# EAGLE design Qwiic_Hall_Effect_Sensor_TMAG5273 (EAGLE 9.6.2)
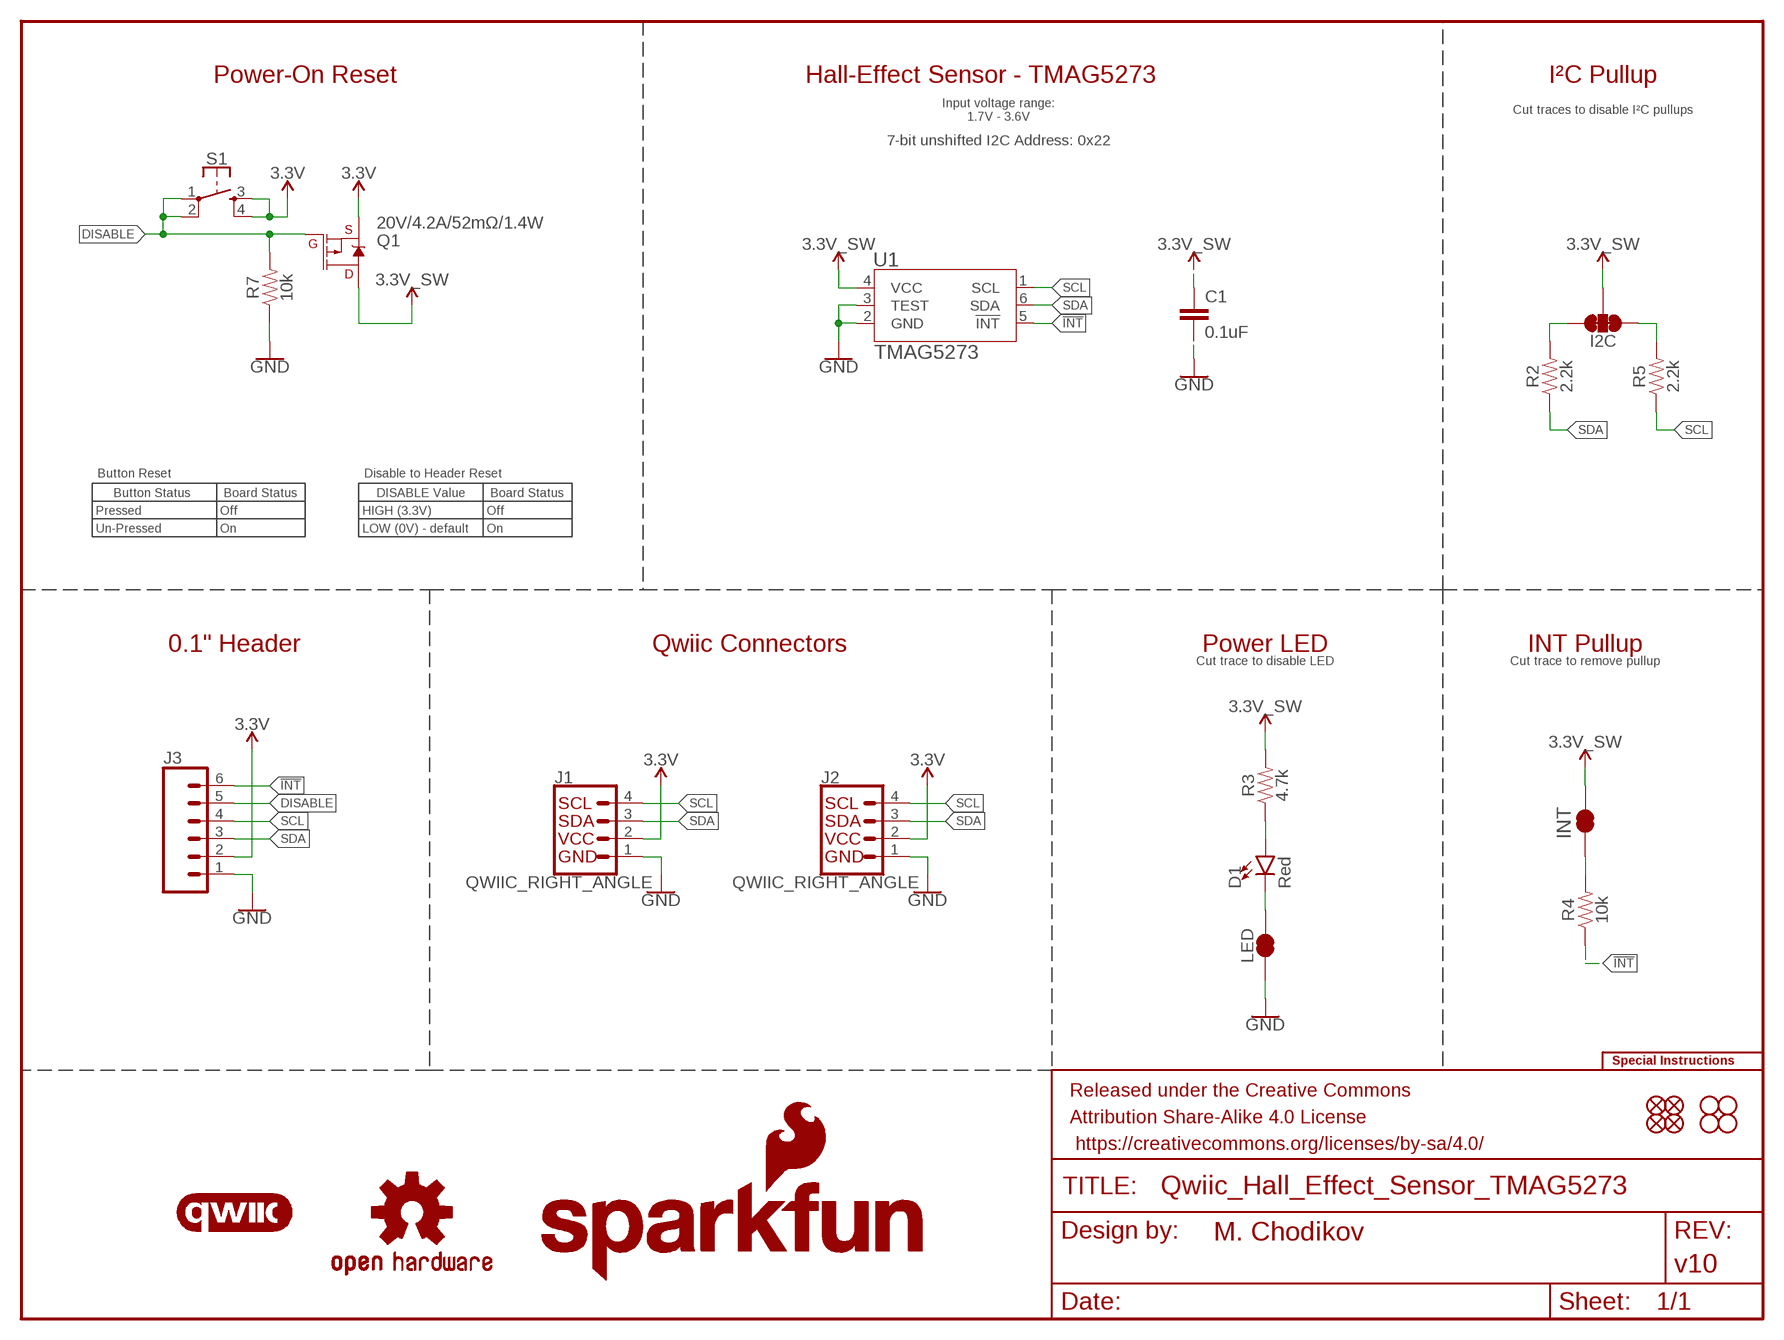
[diagram p0: schematic, sheet 1]

## Parts
C1  0.1uF  0.1UF-0603-25V-10%-X7R-WE  [0603]
D1  Red  LED-RED_0603-KB  [LED-0603]
FD1  FIDUCIAL1X2  [FIDUCIAL-1X2]
FD2  FIDUCIAL1X2  [FIDUCIAL-1X2]
FD3  FIDUCIAL1X2  [FIDUCIAL-1X2]
FD4  FIDUCIAL1X2  [FIDUCIAL-1X2]
FRAME1  FRAME-LETTER  [CREATIVE_COMMONS]
H1  STAND-OFF  [STAND-OFF]
H2  STAND-OFF  [STAND-OFF]
H3  STAND-OFF  [STAND-OFF]
H4  STAND-OFF  [STAND-OFF]
I2C  JUMPER-SMT_3_2-NC_TRACE_SILK  [SMT-JUMPER_3_2-NC_TRACE_SILK]
J1  QWIIC_RIGHT_ANGLE  QWIIC_CONNECTORJS-1MM  [JST04_1MM_RA]
J2  QWIIC_RIGHT_ANGLE  QWIIC_CONNECTORJS-1MM  [JST04_1MM_RA]
J3  CONN_06NO_SILK_FEMALE_PTH  [1X06_NO_SILK]
JP2  JUMPER-SMT_2_NC_TRACE_SILK  [SMT-JUMPER_2_NC_TRACE_SILK]
LED  JUMPER-SMT_2_NC_TRACE_SILK  [SMT-JUMPER_2_NC_TRACE_SILK]
LOGO1  OSHW-LOGOS  [OSHW-LOGO-S]
LOGO2  SFE_LOGO_NAME_FLAME.1_INCH  [SFE_LOGO_NAME_FLAME_.1]
LOGO3  QWIIC_LOGO_4MM  [QWIIC_4MM]
LOGO4  SFE_LOGO_NAME8_MM  [SFE_LOGO_NAME_8MM]
LOGO5  SPECIAL_INSTRUCTIONS-ORDERING  [ORDERING_INSTRUCTIONS]
LOGO6  SFE_LOGO_FLAME.1_INCH  [SFE_LOGO_FLAME_.1]
Q1  20V/4.2A/52mΩ/1.4W  MOSFET_PCH-DMG2305UX-7  [SOT23-3]
R2  2.2k  2.2KOHM-0603-1/10W-1%  [0603]
R3  4.7k  4.7KOHM-0603-1/10W-1%  [0603]
R4  10k  10KOHM-0603-1/10W-1%  [0603]
R5  2.2k  2.2KOHM-0603-1/10W-1%  [0603]
R7  10k  10KOHM-0603-1/10W-1%  [0603]
S1  MOMENTARY-SWITCH-SPST-2-SMD-4.6X2.8MM  [TACTILE_SWITCH_SMD_4.6X2.8MM]
U1  TMAG5273  TMAG5273A1QDBVT  [SOT23-6_DBV_TEX]

## Nets
3.3V: J1.2 J2.2 J3.2 Q1.2(S) S1.3 S1.4
3.3V_SW: C1.1 I2C.2 JP2.2 Q1.3(D) R3.2 U1.4(VCC)
!INT: J3.6 R4.1 U1.5(!INT)
DISABLE: J3.5 Q1.1(G) R7.2 S1.1 S1.2
GND: C1.2 J1.1 J2.1 J3.1 LED.1 R7.1 U1.2(GND) U1.3(TEST)
N$1: D1.C LED.2
N$2: I2C.3 R2.2
N$4: D1.A R3.1
N$5: JP2.1 R4.2
N$6: I2C.1 R5.2
SCL: J1.4 J2.4 J3.4 R5.1 U1.1(SCL)
SDA: J1.3 J2.3 J3.3 R2.1 U1.6(SDA)

## Notes on the sheet
- Power-On Reset | Hall-Effect Sensor - TMAG5273 | I²C Pullup
- Input voltage range:
  1.7V - 3.6V
- Cut traces to disable I²C pullups
- 7-bit unshifted I2C Address: 0x22
- Button Reset | Disable to Header Reset
- Button Status | Board Status | DISABLE Value | Board Status
- Pressed | Off | HIGH (3.3V) | Off
- Un-Pressed | On | LOW (0V) - default | On
- 0.1" Header | Qwiic Connectors | Power LED | INT Pullup
- Cut trace to disable LED | Cut trace to remove pullup
- INT

## Library data of the parts
C1 = SparkFun-Capacitors:0.1UF: 0.1µF ceramic capacitors A capacitor is a passive two-terminal electrical component used to store electrical energy temporarily in an electric field.; PROD_ID: CAP-16503
D1 = SparkFun-LED:LED-RED: Red SMD LED Used in manufacturing of most products at SparkFun Packages: 0603 - KB - KingBright (DIO-17976) SMD 0603 package [Datasheet] <https://www.kingbrightusa.com/images/catalog/SPEC/APT1608SURCK.pdf> 0603 - (DIO-00819, has gone EOL) SMD 0603 package 0603 SMART - SMD 0603 SMART package ( more efficient and expensive)[Product Link] <http://www.osram-os.com/Graphics/XPic2/00077099_0.pdf> 1206 - SMD1206 package [Product Link] <https://www.sparkfun.com/datasheets/DevTools/LilyPad/Q150OVS4.pdff> SparkFun Products: Pro Mini 328 -5V <https://www.sparkfun.com/products/821> RedBoard <https://www.sparkfun.com/products/12757> IOIO-OTG <https://www.sparkfun.com/products/13613>; PROD_ID: DIO-17976
FD1-FD4 = SparkFun-Aesthetics:FIDUCIAL: Fiducial Alignment Points Point-of-reference for pick-and-place machines and other optical instruments.
FRAME1 = SparkFun-Aesthetics:FRAME-LETTER: Schematic Frame - Letter Standard 8.5x11 US Letter frame; DESIGNER: M. Chodikov; REV: v10
H1-H4 = SparkFun-Hardware:STAND-OFF: Stand Off Drill holes for mechanically mounting via screws, standoffs, etc. Note: Use the keepout ring to avoid running the screw head into surrounding components. Variant Overviews STAND-OFF - Mechanical footprint for a #4 phillips button head screw. STAND-OFF-TIGHT - Mechanical footprint for a #4 phillips button head screw, Example SparkFun Products Screw - Phillips Head (1/4", 4-40, 10 pack) <https://www.sparkfun.com/products/10453> (PRT-10453) Screw - Phillips Head (1/2", 4-40, 10 pack) <https://www.sparkfun.com/products/10452> (PRT-10452) Screw - Phillips Head (3/4", 4-40, 10 pack) <https://www.sparkfun.com/products/10451> (PRT-10451) Screw - Phillips Head (1", 4-40, 10 pack) <https://www.sparkfun.com/products/10450> (PRT-10450)
I2C = SparkFun-Jumpers:JUMPER-SMT_3_2-NC_TRACE: Normally closed trace jumper (2 of 2 connections) This jumper has a trace between all three pads so they are normally closed (NC). Use a razor knife to open the connection(s). For best results follow the IPC guidelines for cutting traces: Cutout at least 0.063 mm (0.005 in). Remove all loose material to clean up the cut area. Seal the cut with an approved epoxy. Reapply solder to reclose the connection(s).
J1 J2 = SparkFun-Connectors:QWIIC_CONNECTOR: SparkFun I2C Standard Qwiic Connector An SMD 1mm pitch JST connector makes it easy and quick (get it? Qwiic?) to connect I2C devices to each other. The Qwiic system <http://www.sparkfun.com/qwiic> enables fast and solderless connection between popular platforms and various sensors and actuators. We carry 200mm <https://www.sparkfun.com/products/14204>, 100mm <https://www.sparkfun.com/products/14205>, 50mm <https://www.sparkfun.com/products/14206>, and breadboard friendly <https://www.sparkfun.com/products/14207> Qwiic cables. We also offer 10 pcs strips <https://www.sparkfun.com/products/14323> the SMD connectors.; PROD_ID: CONN-13694
J3 = SparkFun-Connectors:CONN_06: Multi connection point. Often used as Generic Header-pin footprint for 0.1 inch spaced/style header connections On any of the 0.1 inch spaced packages, you can populate with these: Break Away Headers - Straight <https://www.sparkfun.com/products/116> (PRT-00116) Break Away Male Headers - Right Angle <https://www.sparkfun.com/products/553> (PRT-00553) Female Headers <https://www.sparkfun.com/products/115> (PRT-00115) Break Away Headers - Machine Pin <https://www.sparkfun.com/products/117> (PRT-00117) Break Away Female Headers - Swiss Machine Pin <https://www.sparkfun.com/products/743> (PRT-00743) Arduino Stackable Header - 6 Pin <https://www.sparkfun.com/products/9280> (PRT-09280) Screw Terminals 2.54mm Pitch (6-Pin) <https://www.sparkfun.com/products/16499> (PRT-16499) For SCREWTERMINALS and SPRING TERMINALS visit here: Screw Terimnals on SparkFun.com <https://www.sparkfun.com/search/results?term=Screw+Terminals> (5mm/3.5mm/2.54mm spacing) This device is also useful as a general connection point to wire up your design to another part of your project. Our various solder wires solder well into these plated through hole pads. Hook-Up Wire - Assortment (Stranded, 22 AWG) <https://www.sparkfun.com/products/11375> (PRT-11375) Hook-Up Wire - Assortment (Solid Core, 22 AWG) <https://www.sparkfun.com/products/11367> (PRT-11367) View the entire wire category on our website here <https://www.sparkfun.com/categories/141>; PROD_ID: CONN-08437
JP2 LED = SparkFun-Jumpers:JUMPER-SMT_2_NC_TRACE: Normally closed trace jumper This jumper has a trace between two pads so it's normally closed (NC). Use a razor knife to open the connection. For best results follow the IPC guidelines for cutting traces: Cutout at least 0.063 mm (0.005 in). Remove all loose material to clean up the cut area. Seal the cut with an approved epoxy. Reapply solder to reclose the connection.
LOGO1 = SparkFun-Aesthetics:OSHW-LOGO: Open-Source Hardware (OSHW) Logo This logo indicates the piece of hardware it is found on incorporates a OSHW license and/or adheres to the definition of open source hardware found here: http://freedomdefined.org/OSHW
LOGO2 = SparkFun-Aesthetics:SFE_LOGO_NAME_FLAME: SparkFun Font Logo w/ Flame This is the SparkFun full logo. The logo on the schematic will always be the same size; the package variant is the height of the flame part of the logo. Default layer for the logo on the board is tSilk.
LOGO3 = SparkFun-Aesthetics:QWIIC_LOGO: Qwiic Logos for placement on schematic and PCB. The 5.5mm silk logo is best for placing next to Qwiic connector.
LOGO4 = SparkFun-Aesthetics:SFE_LOGO_NAME: SparkFun Font Logo This is the SparkFun name logo. The logo on the schematic will always be the same size; the package variant is the height of the flame part of the logo (or the height the flame would be, if it were drawn). Default layer for the logo on the board is tSilk.
LOGO5 = SparkFun-Aesthetics:SPECIAL_INSTRUCTIONS: Special Ordering/Production Instructions Alert Symbol for special PCB ordering instructions or unique production process warnings. Ordering Instructions Production Instructions Types of information that should be added to box: Copper weight Soldermask color Silk color PCB thickness Number of layers PCB Standard: 1.6mm FR4 1 oz copper immersion silver plating red soldermask white silkscreen Types of information that should be added to box: Special wash requirements Depaneling instructions Humidification Glue curing Default text settings: 0.07 inch 9% ratio 50% line distance
LOGO6 = SparkFun-Aesthetics:SFE_LOGO_FLAME: SparkFun Flame Logo This is the SparkFun flame logo. The logo on the schematic will always be the same size; the package variant is the height of the flame. Default layer for the logo on the board is tSilk.
Q1 = SparkFun-DiscreteSemi:MOSFET_PCH: P-channel MOSFETs Voltage controlled devices that allow control of high current outputs. SparkFun Products: SparkFun ESP32 Thing <https://www.sparkfun.com/products/13907> SparkFun ESP8266 Thing <https://www.sparkfun.com/products/13231> SparkFun Pi Servo HAT V2 <https://www.sparkfun.com/products/15316> DMG2305UX-7 (20V/4.2A/SOT23-3); PROD_ID: TRANS-14388
R2 R5 = SparkFun-Resistors:2.2KOHM: 2.2kΩ resistor A resistor is a passive two-terminal electrical component that implements electrical resistance as a circuit element. Resistors act to reduce current flow, and, at the same time, act to lower voltage levels within circuits. - Wikipedia; PROD_ID: RES-08272
R3 = SparkFun-Resistors:4.7KOHM: 4.7kΩ resistor A resistor is a passive two-terminal electrical component that implements electrical resistance as a circuit element. Resistors act to reduce current flow, and, at the same time, act to lower voltage levels within circuits. - Wikipedia; PROD_ID: RES-07857
R4 R7 = SparkFun-Resistors:10KOHM: 10kΩ resistor A resistor is a passive two-terminal electrical component that implements electrical resistance as a circuit element. Resistors act to reduce current flow, and, at the same time, act to lower voltage levels within circuits. - Wikipedia; PROD_ID: RES-00824
S1 = SparkFun-Switches:MOMENTARY-SWITCH-SPST-2: Momentary Switch (Pushbutton) - SPST - Two Circuits Normally-open (NO) SPST momentary switches (buttons, pushbuttons). Schematic symbol includes two switch circuits. Variants SMD-4.6MMX2.8MM - 4.60mm x 2.80mm Tactile Momentary Button Switch - Used on SparkFun Pro Micro - RP2040 <https://www.sparkfun.com/products/17717> SMD-5.2MM - Mini Pushbutton Switch - SMD <https://www.sparkfun.com/products/8720> - Used on Arduino Pro Mini <https://www.sparkfun.com/products/11114>; PROD_ID: SWCH-15606
U1 = TMAG5273:TMAG5273A1QDBVT: Board Mount Hall Effect / Magnetic Sensors This IC is a low-power linear 3D hall-effect sensor with I2C interface. This device integrates three independent Hall-effect sensors in the X, Y, and Z axes. Datasheet <https://www.ti.com/lit/ds/symlink/tmag5273.pdf?HQS=dis-mous-null-mousermode-dsf-pf-null-wwe&ts=1679672375534&ref_url=https%253A%252F%252Fwww.mouser.co.uk%252F>; PROD_ID: ROB-18440

## Board
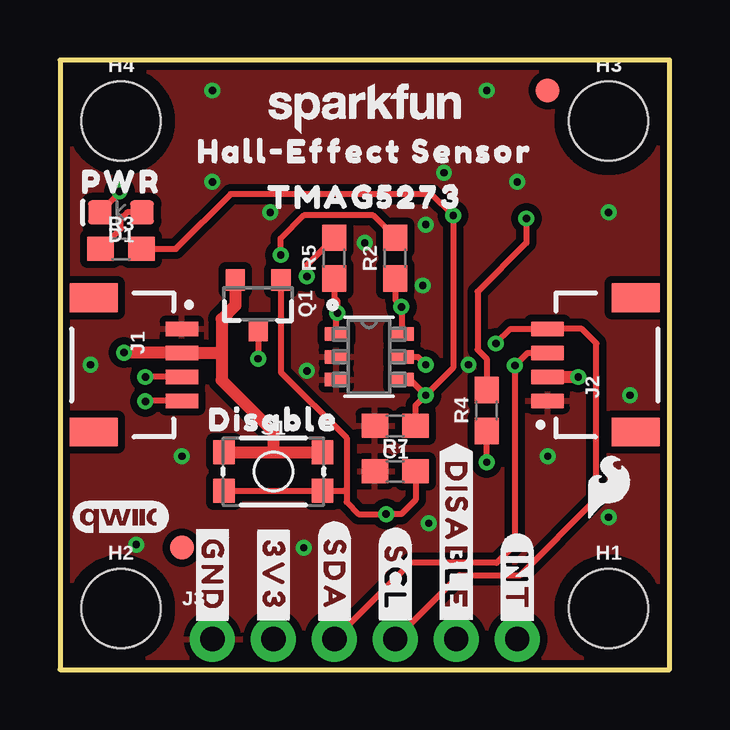
[diagram p1: board, top side]
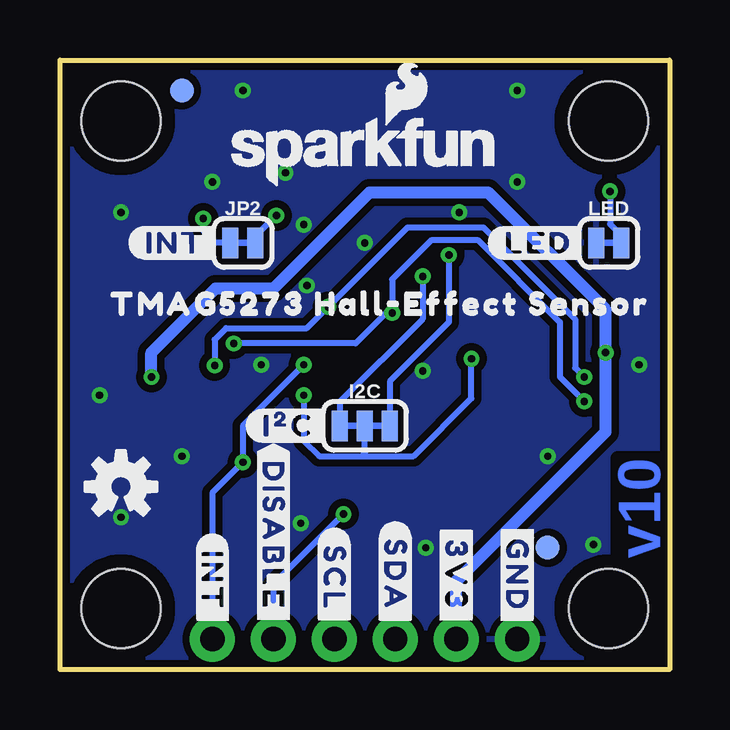
[diagram p2: board, bottom side, seen from below]

Size 25.4 x 25.4 mm. Coordinates in mm from the lower left corner, seen from the top.
Outline: 0,0 25.4,0 25.4,25.4 0,25.4 0,0
Copper layers (1*16): Top 0.035mm / dielectric 1.5mm / Bottom 0.035mm
Design rules "SparkFun-2-Layer-General-JLCPCB": minimum track width 7mil, minimum drill 0.3mm, track to track 7mil, track to pad 7mil, pad to pad 7mil, via to via 7mil, smd to smd 7mil, copper to edge 7mil, drill to drill 7mil, minimum pad ring 7mil, minimum via ring 7mil, stop-mask expansion 3mil, vias tented up to drill 25mil, thermal gap 10mil

### Footprints (pad centres in the part's own frame; a part is rotated, then mirrored left to right if it is on the bottom)
0603 = smd 1.1 x 1: 1 -0.85,0; 2 0.85,0
LED-0603 = smd 1 x 1: A -0.877,0; C 0.877,0
FIDUCIAL-1X2 = smd 1 x 1: 1 0,0
STAND-OFF = hole 3.302: 0,0
SMT-JUMPER_3_2-NC_TRACE_SILK = smd 0.66 x 1.27: 1 -1.041,0; 2 0,0; 3 1.041,0
JST04_1MM_RA = smd 0.6 x 1.35: 1 -1.5,0; 2 -0.5,0; 3 0.5,0; 4 1.5,0 | smd 1.2 x 2: NC1 2.8,-3.675; NC2 -2.8,-3.675
1X06_NO_SILK = drill 1.016 pad 1.88: 1 0,0; 2 2.54,0; 3 5.08,0; 4 7.62,0; 5 10.16,0; 6 12.7,0
SMT-JUMPER_2_NC_TRACE_SILK = smd 0.66 x 1.27: 1 -0.521,0; 2 0.521,0
SOT23-3 = smd 0.8 x 0.9: 1 -0.95,-1; 2 0.95,-1; 3 0,1.1
TACTILE_SWITCH_SMD_4.6X2.8MM = smd 0.9 x 1: 1 -2.05,-0.8; 2 2.05,-0.8; 3 2.05,0.8; 4 -2.05,0.8
SOT23-6_DBV_TEX = smd 0.978 x 0.559: 1 -1.365,0.95; 2 -1.365,0; 3 -1.365,-0.95; 4 1.365,-0.95; 5 1.365,0; 6 1.365,0.95

### Placement (x,y rotation side)
C1  13.97,10.16 180 top
D1  2.54,19.05 180 top
FD1  5.08,5.08 0 bottom
FD2  5.08,5.08 0 top
FD3  20.32,24.13 0 bottom
FD4  20.32,24.13 0 top
FRAME1  -6.35,-40.64 0 top  (outside the outline)
H1  22.86,2.54 0 top
H2  2.54,2.54 0 top
H3  22.86,22.86 0 top
H4  2.54,22.86 0 top
I2C  12.7,10.16 0 bottom
J1  5.08,12.7 270 top
J2  20.32,12.7 90 top
J3  6.35,1.27 0 top
JP2  17.78,17.78 0 bottom
LED  2.54,17.78 0 bottom
LOGO1  22.86,7.62 0 bottom
LOGO2  12.7,21.59 0 bottom
LOGO3  2.54,6.35 0 top
LOGO4  12.7,23.5 0 top
LOGO5  44.45,50.8 0 top  (outside the outline)
LOGO6  22.86,7.62 0 top
Q1  8.26,15.24 180 top
R2  13.97,17.14 90 top
R3  2.54,17.53 0 top
R4  17.78,10.79 90 top
R5  11.43,17.14 90 top
R7  13.97,8.26 0 top
S1  8.89,8.26 0 top
U1  12.88,13.03 0 top
U$1  [#3V3#37]  8.89,3.94 270 top
U$2  [#GND#36]  6.35,3.94 270 top
U$3  [#SDA#37]  11.43,3.94 270 top
U$4  [#SCL#38]  13.97,3.81 270 top
U$5  [#INT#5285]  19.05,3.68 270 top
U$6  [#INT#5289]  20.57,17.78 0 bottom
U$7  [PWR41]  2.54,20.32 0 top
U$8  [#LED#42]  5.46,17.78 0 bottom
U$9  [#DISABLE#5290]  16.51,5.59 270 top
U$10  [#I�C#0]  17.65,10.16 0 bottom
U$11  [HALL#EFFECT_SENSOR45]  12.7,21.59 0 top
U$12  [TMAG527346]  12.7,19.68 0 top
U$13  [DISABLE5281]  8.89,10.41 0 top
U$14  [#SDA#5280]  11.43,3.94 270 bottom
U$15  [#DISABLE#5290]  16.51,5.59 270 bottom
U$16  [#SCL#5281]  13.97,3.81 270 bottom
U$17  [#INT#5285]  19.05,3.68 270 bottom
U$18  [#3V3#0]  8.89,3.94 270 bottom
U$19  [#GND#4]  6.35,3.94 270 bottom
U$20  [TMAG5273_HALL#EFFECT_SENSOR5]  12.06,15.24 0 bottom

### Tracks (layer width: path | path; a pad name or v marks a point on that pad's centre or on a via)
3.3V  (via drill 0.3)
  Top 0.508: J2.2 v21.58,12.2 v21.59,12.19 | v2.67,13.21 v2.67,13.2 J1.2 6.72,13.2 6.73,13.21 | S1.4 8.89,9.05 | 8.89,9.05 S1.3 | Q1.2 7.3,15.18 6.73,14.61 6.73,13.21 | 8.89,9.05 8.89,9.91 6.73,12.06 6.73,13.21
  Bottom 0.508: J3.2 8.89,3.68 2.67,9.91 v2.67,13.21 2.67,14.99 7.56,19.88 12.51,19.88 16.51,15.88 18.92,15.88 21.59,13.21 v21.59,12.19
3.3V_SW  (via drill 0.3)
  Top 0.254: R3.2 4.83,17.53 7.11,19.81 15.49,19.81 v16.38,18.92 16.38,12.57 v15.24,11.43 | U1.4 14.59,12.08 v15.24,11.43 | C1.1 14.82,11.01 v15.24,11.43 | Q1.3 v8.26,12.95
  Bottom 0.254: v15.24,11.43 15.24,9.53 14.61,8.89 12.83,8.89 | 12.83,8.89 12.7,9.02 I2C.2 | 12.83,8.89 10.67,8.89 8.26,11.3 v8.26,12.95 | v16.38,18.92 17.26,18.05 JP2.2
!INT  (via drill 0.3)
  Top 0.254: U1.5 14.91,13.03 v15.24,12.7 | v17.78,8.64 R4.1
  Bottom 0.254: J3.6 19.05,7.37 v17.78,8.64 17.78,10.16 v15.24,12.7
DISABLE  (via drill 0.3)
  Top 0.254: Q1.1 9.21,12.38 11.94,9.65 11.94,7.37 | 11.94,7.37 11.94,6.99 12.45,6.48 v13.59,6.48 14.22,6.48 14.82,7.07 R7.2 | S1.1 S1.2 11.85,7.46 11.94,7.37
  Bottom 0.254: v13.59,6.48 16.51,3.56 J3.5
GND  (via drill 0.3)
  other vias: 5.08,8.89 20.32,8.89 19.05,20.32 10.29,12.45 6.35,20.32 15.11,16 16,20.7 8.76,19.05 22.86,6.35 23.75,11.43 12.7,17.78 1.27,12.7 15.37,6.1 17.02,12.7 3.17,5.21 22.86,19.05 17.78,24.13 6.35,24.13 10.16,5.08 15.24,18.54
  pour Top (isolate 0.305): 0,0 25.4,0 25.4,25.4 0,25.4
  pour Bottom (isolate 0.305): 0,0 25.4,0 25.4,25.4 0,25.4
N$1  (via drill 0.3)
  Top 0.254: v2.48,19.93 2.48,19.87 D1.C
  Bottom 0.254: v2.48,19.93 2.48,18.56 2.23,18.31 2.23,17.99 LED.2
N$2  (via drill 0.3)
  Top 0.254: R2.2 13.04,18.92 10.16,18.92 9.2,17.96 v9.2,17.27
  Bottom 0.254: I2C.3 11.66,12.01 9.2,14.48 v9.2,17.27
N$4
  Top 0.254: D1.A 2.79,19.05 2.54,18.8 2.54,18.37 R3.1
N$5  (via drill 0.3)
  Top 0.254: v19.43,18.8 19.43,17.78 17.4,15.75 17.4,13.34 17.78,12.95 R4.2
  Bottom 0.254: JP2.1 18.92,17.78 19.43,18.29 v19.43,18.8
N$6  (via drill 0.3)
  Top 0.254: R5.2 10.29,16.85 v10.29,16.38
  Bottom 0.254: v10.29,16.38 10.29,14.61 13.74,11.15 I2C.1
SCL  (via drill 0.3)
  Top 0.254: R5.1 11.43,15.49 11.56,15.37 v11.56,14.86 11.51,14.81 U1.1 | J1.4 3.58,11.2 v3.56,11.18 | v18.16,13.59 18.77,14.2 J2.4 21.74,14.2 22.35,13.59 22.35,7.11 19.18,3.94 16.64,3.94 J3.4
  Bottom 0.254: v3.56,11.18 4.57,12.19 4.57,14.48 8,17.91 9.91,17.91 11.56,16.26 v11.56,14.86 11.81,14.86 13.08,13.59 v18.16,13.59
SDA  (via drill 0.3)
  Top 0.254: R2.1 13.97,15.41 14.22,15.15 v14.22,15.11 14.24,15.09 U1.6 | J1.3 v3.56,12.2 v3.56,12.19 | J2.3 19.48,13.2 v18.95,12.67 18.95,5.21 18.19,4.45 14.61,4.45 J3.3
  Bottom 0.254: v3.56,12.19 3.94,12.57 3.94,14.61 7.75,18.41 10.92,18.41 v14.22,15.11 15.11,14.22 18.48,14.22 18.95,13.75 v18.95,12.67

### Text on the board
Bottom: v10
Measures: Units in inches
tDocu: Solder Mask: Red / Thickness: 1.6mm / Two layer design / Finish: HASL Lead-Free / Copper Weight: 1oz / Material: TG135-140 | M. Chodikov